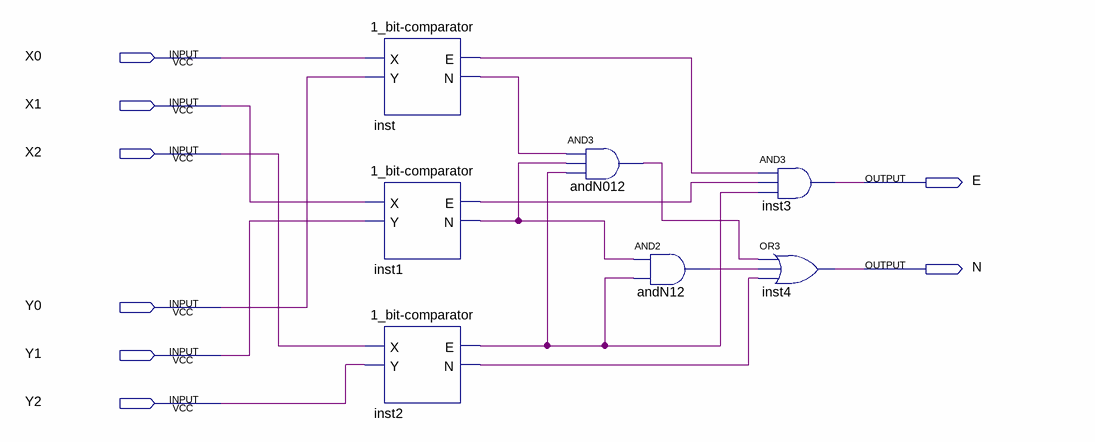
[diagram p0: schematic sheet]
// Quartus schematic project_01.bdf as structural Verilog: 7 symbols, 8 pins
module project_01 (
  input  X0,
  input  X1,
  input  X2,
  input  Y0,
  input  Y1,
  input  Y2,
  output E,
  output N
);

  wire andN12_out, andN012_out, inst1_e, inst1_n, inst2_e, inst2_n, inst_e, inst_n;

  \1_bit-comparator  inst (.X(X0), .Y(Y0), .E(inst_e), .N(inst_n));
  \1_bit-comparator  inst1 (.X(X1), .Y(Y1), .E(inst1_e), .N(inst1_n));
  \1_bit-comparator  inst2 (.X(X2), .Y(Y2), .E(inst2_e), .N(inst2_n));
  and andN012 (andN012_out, inst_n, inst1_n, inst2_e);
  and andN12 (andN12_out, inst1_n, inst2_e);
  and inst3 (E, inst_e, inst1_e, inst2_e);
  or inst4 (N, andN012_out, andN12_out, inst2_n);
endmodule
